# EAGLE design AC based repeater V3 (EAGLE 7.3.0)
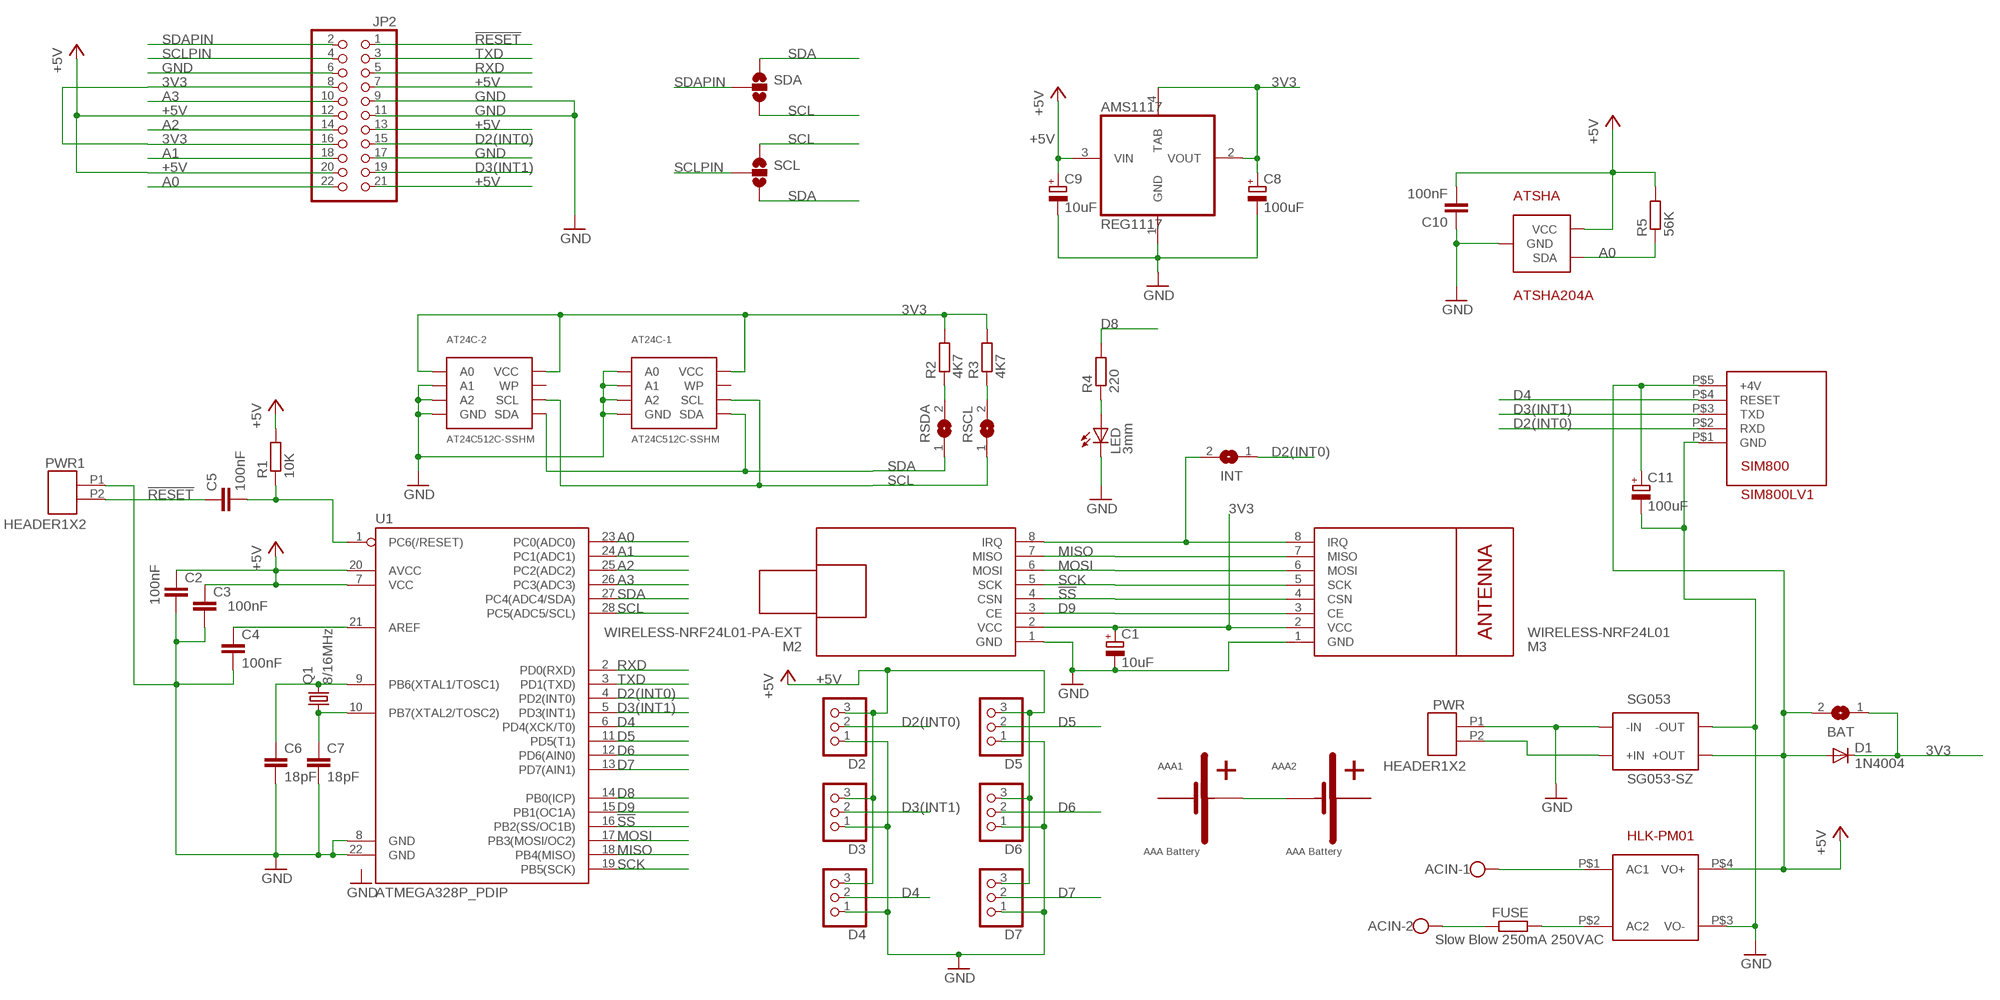
[diagram p0: schematic, sheet 1]

## Parts
AAA1  AAA Battery  AAABATTERYPLUSPIN  [AAABATTERYHOLDERPLUSPIN]
AAA2  AAA Battery  AAABATTERYMINPIN  [AAABATTERYHOLDERMINPIN]
ACIN  W237-102  [W237-102]
AMS1117  REG1117  [SOT223]
AT24C-1  AT24C512C-SSHM  AT24C32SOIC8  [SOIC8]
AT24C-2  AT24C512C-SSHM  AT24C32SOIC8  [SOIC8]
ATSHA  ATSHA204A  [SOT23-R]
BAT  SJ  [SJ]
C1  10uF  CPOL-EUE2.5-5  [E2,5-5]
C2  100nF  C-EU025-025X050  [C025-025X050]
C3  100nF  C-EU025-025X050  [C025-025X050]
C4  100nF  C-EU025-025X050  [C025-025X050]
C5  100nF  C-EU025-025X050  [C025-025X050]
C6  18pF  C-EU025-025X050  [C025-025X050]
C7  18pF  C-EU025-025X050  [C025-025X050]
C8  100uF  CPOL-EUE3.5-8  [E3,5-8]
C9  10uF  CPOL-EUE2.5-5  [E2,5-5]
C10  100nF  C-EU025-025X050  [C025-025X050]
C11  100uF  CPOL-EUE3.5-8  [E3,5-8]
D1  1N4004  [DO41-10]
D2  PINHD-1X3PTH  [1X03]
D3  PINHD-1X3PTH  [1X03]
D4  PINHD-1X3PTH  [1X03]
D5  PINHD-1X3PTH  [1X03]
D6  PINHD-1X3PTH  [1X03]
D7  PINHD-1X3PTH  [1X03]
FUSE  Slow Blow 250mA 250VAC  R-EU_0411/3V  [0411V]
HLK-PM01  HLK-PM01  [HLK-PM01]
INT  SJ  [SJ]
JP2  PINHD-2X11  [2X11]
LED  3mm  LED3MM  [LED3MM]
M2  WIRELESS-NRF24L01-PA-EXT  [WIRELESS-NRD24L01-PA-EXT]
M3  WIRELESS-NRF24L01  [WIRELESS-NRF24L01]
PWR  HEADER1X2  [HEADER1X2]
PWR1  HEADER1X2  [HEADER1X2]
Q1  8/16MHz  CRYSTALHC49U-V  [HC49U-V]
R1  10K  R-EU_0207/7  [0207/7]
R2  4K7  R-EU_0207/7  [0207/7]
R3  4K7  R-EU_0207/7  [0207/7]
R4  220  R-EU_0207/7  [0207/7]
R5  56K  R-EU_0207/7  [0207/7]
RSCL  SJ  [SJ]
RSDA  SJ  [SJ]
SCL  JUMPER-PAD-3-NC_BY_TRACE  [PAD-JUMPER-3-3OF3_NC_BY_TRACE_YES_SILK_FULL_BOX]
SDA  JUMPER-PAD-3-NC_BY_TRACE  [PAD-JUMPER-3-3OF3_NC_BY_TRACE_YES_SILK_FULL_BOX]
SG053  SG053-SZ  [SG053-SZ]
SIM800  SIM800LV1  [SIM800LV1]
U1  ATMEGA328P_PDIP  [DIL28-3]

## Nets
3V3 [dcpower]: AMS1117.2(VOUT) AMS1117.4(TAB) AT24C-1.8(VCC) AT24C-2.1(A0) AT24C-2.8(VCC) BAT.1 C1.+ C8.+ D1.C JP2.8 JP2.16 M2.2(VCC) M3.2(VCC) R2.2 R3.2
!RESET: C5.1 JP2.1 PWR1.P2
!SS: M2.4(CSN) M3.4(CSN) U1.16(PB2(SS/OC1B))
+5V [dcpower]: AMS1117.3(VIN) ATSHA.2(VCC) BAT.2 C2.1 C3.1 C9.+ C10.2 C11.+ D1.A D2.3 D3.3 D4.3 D5.3 D6.3 D7.3 HLK-PM01.P$4(VO+) JP2.7 JP2.12 JP2.13 JP2.20 JP2.21 R1.2 R5.2 SG053.P$5(+OUT) SG053.P$6(+OUT) SIM800.P$5(+4V) U1.7(VCC) U1.20(AVCC)
A0: ATSHA.1(SDA) JP2.22 R5.1 U1.23(PC0(ADC0))
A1: JP2.18 U1.24(PC1(ADC1))
A2: JP2.14 U1.25(PC2(ADC2))
A3: JP2.10 U1.26(PC3(ADC3))
D2(INT0): D2.2 INT.1 JP2.15 SIM800.P$2(RXD) U1.4(PD2(INT0))
D3(INT1): D3.2 JP2.19 SIM800.P$3(TXD) U1.5(PD3(INT1))
D4: D4.2 SIM800.P$4(RESET) U1.6(PD4(XCK/T0))
D5: D5.2 U1.11(PD5(T1))
D6: D6.2 U1.12(PD6(AIN0))
D7: D7.2 U1.13(PD7(AIN1))
D8: R4.2 U1.14(PB0(ICP))
D9: M2.3(CE) M3.3(CE) U1.15(PB1(OC1A))
GND [dcpower]: AMS1117.1(GND) AT24C-1.1(A0) AT24C-1.2(A1) AT24C-1.3(A2) AT24C-1.4(GND) AT24C-2.2(A1) AT24C-2.3(A2) AT24C-2.4(GND) ATSHA.3(GND) C1.- C2.2 C3.2 C4.2 C6.2 C7.2 C8.- C9.- C10.1 C11.- D2.1 D3.1 D4.1 D5.1 D6.1 D7.1 HLK-PM01.P$3(VO-) JP2.6 JP2.9 JP2.11 JP2.17 LED.K(C) M2.1(GND) M3.1(GND) PWR1.P1 PWR.P1 SG053.P$1(-IN) SG053.P$2(-IN) SG053.P$7(-OUT) SG053.P$8(-OUT) SIM800.P$1(GND) U1.8(GND) U1.22(GND)
MISO: M2.7(MISO) M3.7(MISO) U1.18(PB4(MISO))
MOSI: M2.6(MOSI) M3.6(MOSI) U1.17(PB3(MOSI/OC2))
N$1 [dcpower]: PWR.P2 SG053.P$3(+IN) SG053.P$4(+IN)
N$2: R2.1 RSDA.2
N$4 [acpower]: ACIN.2 FUSE.1
N$5: C4.1 U1.21(AREF)
N$6: R3.1 RSCL.2
N$7 [dcpower]: AAA1.P$2 AAA2.P$1
N$8 [acpower]: ACIN.1 HLK-PM01.P$1(AC1)
N$9 [acpower]: FUSE.2 HLK-PM01.P$2(AC2)
N$10: C5.2 R1.1 U1.1(PC6(/RESET))
N$12: INT.2 M2.8(IRQ) M3.8(IRQ)
N$28: LED.A R4.1
N$35: C6.1 Q1.2 U1.9(PB6(XTAL1/TOSC1))
N$36: C7.1 Q1.1 U1.10(PB7(XTAL2/TOSC2))
RXD: JP2.5 U1.2(PD0(RXD))
SCK: M2.5(SCK) M3.5(SCK) U1.19(PB5(SCK))
SCL: AT24C-1.6(SCL) AT24C-2.6(SCL) RSCL.1 SCL.1 SDA.3 U1.28(PC5(ADC5/SCL))
SCLPIN: JP2.4 SCL.2
SDA: AT24C-1.5(SDA) AT24C-2.5(SDA) RSDA.1 SCL.3 SDA.1 U1.27(PC4(ADC4/SDA))
SDAPIN: JP2.2 SDA.2
TXD: JP2.3 U1.3(PD1(TXD))
Unconnected: AT24C-1.7(WP) AT24C-2.7(WP)

## Library data of the parts
AAA1 = GertSanders:AAABATTERYPLUSPIN
AAA2 = GertSanders:AAABATTERYMINPIN
ACIN = con-wago-500:W237-102: WAGO SCREW CLAMP; MPN: 237-102; OC_FARNELL: unknown; OC_NEWARK: 70K9898
AMS1117 = BaseApp:REG1117: 800mA and 1A Low Dropout (LDO) Positive Regulator 1.8V, 2.5V, 2.85V, 3.3V, 5V, and Adj http://www.digikey.com/product-detail/en/LM1117MPX-3.3%2FNOPB/LM1117MPX-3.3CT-ND/1010516
AT24C-1 AT24C-2 = GertSanders:AT24C32
ATSHA = GertSanders:ATSHA204A
BAT INT RSCL RSDA = jumper:SJ: SMD solder JUMPER
C1 C8 C9 C11 = rcl:CPOL-EU: POLARIZED CAPACITOR, European symbol
C2-C7 C10 = GertSanders:C-EU: CAPACITOR, European symbol
D1 = diode:1N4004: DIODE general purpose rectifier, 1 A
D2-D7 = digital-toy:PINHD-1X3: PIN HEADER
FUSE R1-R5 = rcl:R-EU_: RESISTOR, European symbol
HLK-PM01 = GertSanders:HLK-PM01: HI-LINK Ultra-compact power module HLK-PM01 Meet UL, CE requirements Ultra-thin, ultra-small All voltage input (AC: 90 ~ 264V) Low ripple and low noise Output overload and short circuit protection High efficiency, high power density The product is designed to meet the requirements of EMC and Safety Test Low power consumption, environmental protection, no-load loss <0.1W 100% load aging and testing
JP2 = pinhead:PINHD-2X11: PIN HEADER
LED = adafruit:LED: LED OSRAM: - CHIPLED LG R971, LG N971, LY N971, LG Q971, LY Q971, LO R971, LY R971 LH N974, LH R974 LS Q976, LO Q976, LY Q976 LO Q996 - Hyper CHIPLED LW Q18S LB Q993, LB Q99A, LB R99A - SideLED LS A670, LO A670, LY A670, LG A670, LP A670 LB A673, LV A673, LT A673, LW A673 LH A674 LY A675 LS A676, LA A676, LO A676, LY A676, LW A676 LS A679, LY A679, LG A679 - Hyper Micro SIDELED® LS Y876, LA Y876, LO Y876, LY Y876 LT Y87S - SmartLED LW L88C, LW L88S LB L89C, LB L89S, LG L890 LS L89K, LO L89K, LY L89K LS L896, LA L896, LO L896, LY L896 - TOPLED LS T670, LO T670, LY T670, LG T670, LP T670 LSG T670, LSP T670, LSY T670, LOP T670, LYG T670 LG T671, LOG T671, LSG T671 LB T673, LV T673, LT T673, LW T673 LH T674 LS T676, LA T676, LO T676, LY T676, LB T676, LH T676, LSB T676, LW T676 LB T67C, LV T67C, LT T67C, LS T67K, LO T67K, LY T67K, LW E67C LS E67B, LA E67B, LO E67B, LY E67B, LB E67C, LV E67C, LT E67C LW T67C LS T679, LY T679, LG T679 LS T770, LO T770, LY T770, LG T770, LP T770 LB T773, LV T773, LT T773, LW T773 LH T774 LS E675, LA E675, LY E675, LS T675 LS T776, LA T776, LO T776, LY T776, LB T776 LHGB T686 LT T68C, LB T68C - Hyper Mini TOPLED® LB M676 - Mini TOPLED Santana® LG M470 LS M47K, LO M47K, LY M47K Source: http://www.osram.convergy.de/
M2 = GertSanders:WIRELESS-NRF24L01-PA-EXT: 2.4 GHz Wireless Module based on NRF24L01 chip with preamplifier and external antenna
M3 = GertSanders:WIRELESS-NRF24L01: 2.4 GHz Wireless Module based on NRF24L01 chip
PWR PWR1 = anton:HEADER1X2
Q1 = crystal:CRYSTAL: CRYSTAL; OC_FARNELL: 1666969; OC_NEWARK: unknown
SCL SDA = GertSanders:JUMPER-PAD-3-NC_BY_TRACE
SG053 = GertSanders:SG053-SZ
SIM800 = GertSanders:SIM800LV1
U1 = GertSanders:ATMEGA328P_PDIP: uC used in the Arduino 32kb flash, 1k EEPROM, 2k SRAM This is the through-hole version of this chip.

## Net classes
1 dcpower: width 0.635 mm
2 acpower: width 2.54 mm, clearance 1.524 mm

## Board
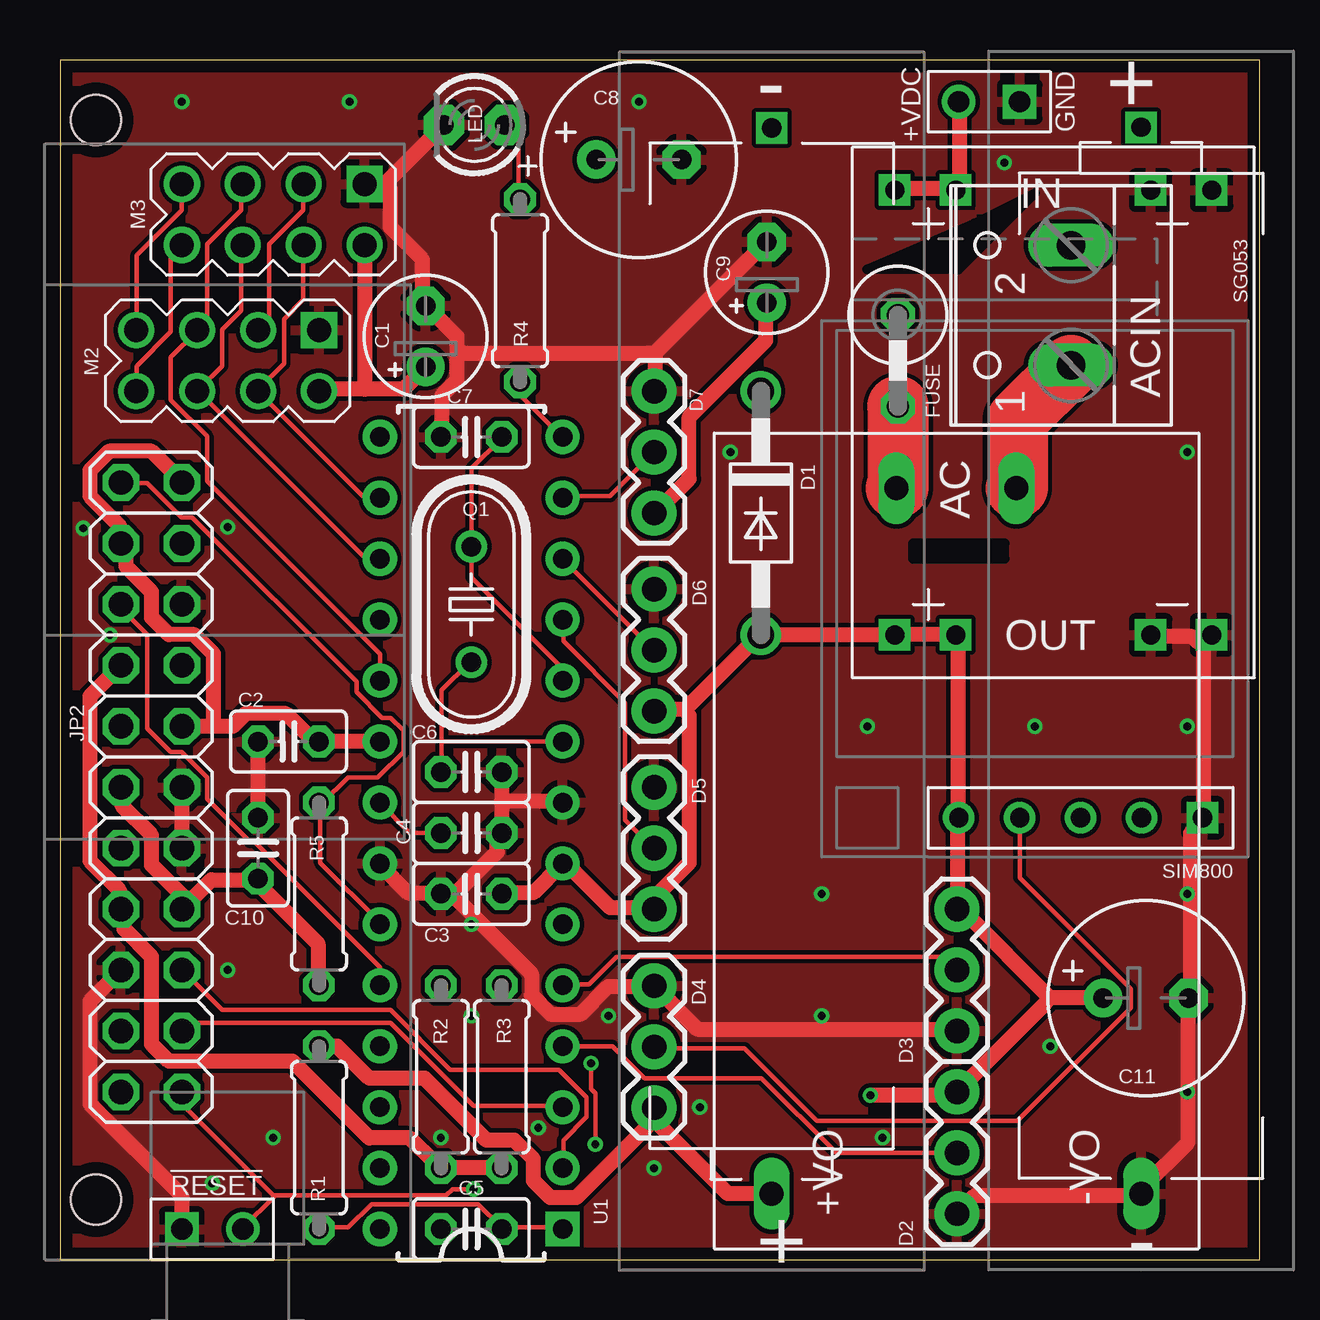
[diagram p1: board, top side]
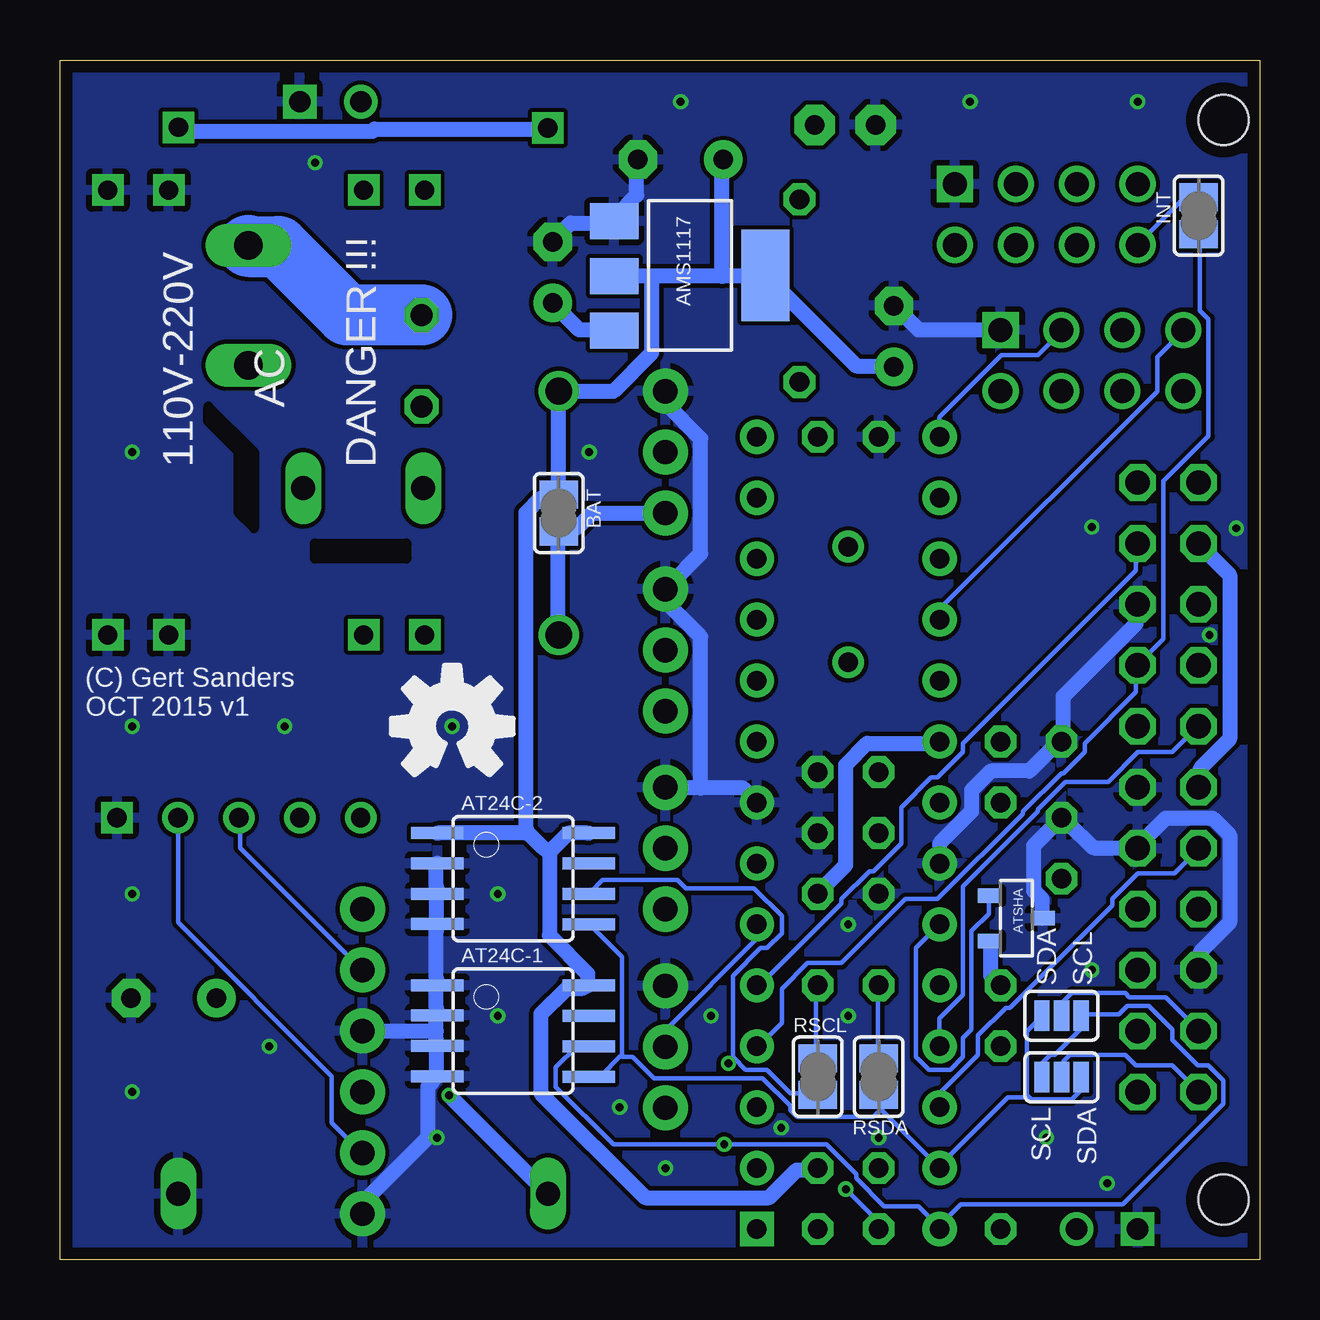
[diagram p2: board, bottom side, seen from below]

Size 50 x 50 mm. Coordinates in mm from the lower left corner, seen from the top.
Outline: 0,0 50,0 50,50 0,50 0,0
Copper layers (1*16): Top 0.035mm / dielectric 1.5mm / Bottom 0.035mm
Design rules "ShenZhen2U EagleRules": minimum track width 7mil, minimum drill 12mil, track to track 7mil, track to pad 7mil, pad to pad 7mil, via to via 7mil, smd to smd 0mil, copper to edge 20mil, drill to drill 10mil, minimum pad ring 10mil, minimum via ring 6mil, stop-mask expansion 2mil, vias tented up to drill 25mil, thermal gap 10mil
Holes 2.1 mm at 1.5,2.5 1.5,47.5
tRestrict: area 33.7,41.3 to 40.6,44.5; area 35.6,29.2 to 39.4,29.8
bRestrict: area 41.9,30.5 to 43.8,35.6; area 35.6,29.2 to 39.4,29.8

### Footprints (pad centres in the part's own frame; a part is rotated, then mirrored left to right if it is on the bottom)
AAABATTERYHOLDERPLUSPIN = drill 0.8 square: P$2 22.225,0
AAABATTERYHOLDERMINPIN = drill 0.8 square: P$1 -22.225,0
W237-102 = drill 1.194 long: 1 -2.5,-1.27; 2 2.5,-1.27
SOT223 = smd 1.499 x 2.007: 1 -2.261,-3.15; 2 0.025,-3.15; 3 2.311,-3.15 | smd 3.81 x 2.007: 4 0,3.15
SOIC8 = smd 0.5 x 2.2: 1 -1.905,-3.154; 2 -0.645,-3.154; 3 0.625,-3.154; 4 1.895,-3.154; 5 1.905,3.154; 6 0.635,3.154; 7 -0.635,3.154; 8 -1.905,3.154
SOT23-R = smd 0.6 x 1: 1 -0.95,-1.1; 2 0.95,-1.1; 3 0,1.1
SJ = smd 1.168 x 1.6: 1 -0.762,0; 2 0.762,0
E2,5-5 = drill 0.813 pad 1.6: + -1.27,0 | drill 0.813 pad 1.6 octagon: - 1.27,0
C025-025X050 = drill 0.813 octagon: 1 -1.27,0; 2 1.27,0
E3,5-8 = drill 0.813 pad 1.6: + -1.778,0 | drill 0.813 pad 1.6 octagon: - 1.778,0
DO41-10 = drill 1.118: A 5.08,0; C -5.08,0
1X03 = drill 1.016 pad 1.88: 1 0,0; 2 2.54,0; 3 5.08,0
0411V = drill 0.914 octagon: 1 -2.54,0; 2 1.27,0
HLK-PM01 = drill 1 long: P$1 -14.7,2.5; P$2 -14.7,-2.5; P$3 14.7,7.7; P$4 14.7,-7.7
2X11 = drill 1.016 octagon: 1 -12.7,-1.27; 2 -12.7,1.27; 3 -10.16,-1.27; 4 -10.16,1.27; 5 -7.62,-1.27; 6 -7.62,1.27; 7 -5.08,-1.27; 8 -5.08,1.27; 9 -2.54,-1.27; 10 -2.54,1.27; 11 0,-1.27; 12 0,1.27; 13 2.54,-1.27; 14 2.54,1.27; 15 5.08,-1.27; 16 5.08,1.27; 17 7.62,-1.27; 18 7.62,1.27; 19 10.16,-1.27; 20 10.16,1.27; 21 12.7,-1.27; 22 12.7,1.27
LED3MM = drill 0.813 pad 1.676 octagon: A -1.27,0; K 1.27,0
WIRELESS-NRD24L01-PA-EXT = drill 1 square: 1 -17.755,3.81 | drill 1: 2 -15.215,3.81; 3 -17.755,1.27; 4 -15.215,1.27; 5 -17.755,-1.27; 6 -15.215,-1.27; 7 -17.755,-3.81; 8 -15.215,-3.81
WIRELESS-NRF24L01 = drill 1 square: 1 -12.7,6.35 | drill 1: 2 -10.16,6.35; 3 -12.7,3.81; 4 -10.16,3.81; 5 -12.7,1.27; 6 -10.16,1.27; 7 -12.7,-1.27; 8 -10.16,-1.27
HEADER1X2 = drill 0.889 square: P1 0,1.27 | drill 0.889: P2 0,-1.27
HC49U-V = drill 0.813: 1 -2.413,0; 2 2.413,0
0207/7 = drill 0.813 octagon: 1 -3.81,0; 2 3.81,0
PAD-JUMPER-3-3OF3_NC_BY_TRACE_YES_SILK_FULL_BOX = smd 0.635 x 1.27: 1 -0.813,0; 2 0,0; 3 0.813,0
SG053-SZ = drill 0.8 square: P$1 -8.382,6.096; P$2 -8.382,3.556; P$3 -8.382,-4.572; P$4 -8.382,-7.112; P$5 10.16,-7.112; P$6 10.16,-4.572; P$7 10.16,3.556; P$8 10.16,6.096
SIM800LV1 = drill 0.8 square: P$1 1.27,1.27 | drill 0.8: P$2 1.27,3.81; P$3 1.27,6.35; P$4 1.27,8.89; P$5 1.27,11.43
DIL28-3 = drill 0.813 pad 1.422 square: 1 -16.51,-3.81 | drill 0.813 pad 1.422: 2 -13.97,-3.81; 3 -11.43,-3.81; 4 -8.89,-3.81; 5 -6.35,-3.81; 6 -3.81,-3.81; 7 -1.27,-3.81; 8 1.27,-3.81; 9 3.81,-3.81; 10 6.35,-3.81; 11 8.89,-3.81; 12 11.43,-3.81; 13 13.97,-3.81; 14 16.51,-3.81; 15 16.51,3.81; 16 13.97,3.81; 17 11.43,3.81; 18 8.89,3.81; 19 6.35,3.81; 20 3.81,3.81; 21 1.27,3.81; 22 -1.27,3.81; 23 -3.81,3.81; 24 -6.35,3.81; 25 -8.89,3.81; 26 -11.43,3.81; 27 -13.97,3.81; 28 -16.51,3.81

### Placement (x,y rotation side)
AAA1  45.06,24.97 90 top
AAA2  29.67,24.94 270 top
ACIN  40.87,39.78 90 top
AMS1117  23.75,41.02 270 bottom
AT24C-1  31.11,9.53 270 bottom
AT24C-2  31.11,15.88 270 bottom
ATSHA  10.13,14.22 270 bottom
BAT  29.21,31.11 270 bottom
C1  15.24,38.48 90 top
C2  9.53,21.59 180 top
C3  17.14,15.24 180 top
C4  17.14,17.78 0 top
C5  17.14,1.27 0 top
C6  17.14,20.32 0 top
C7  17.14,34.29 180 top
C8  24.13,45.85 0 top
C9  29.46,41.15 90 top
C10  8.26,17.14 270 top
C11  45.26,10.9 0 top
D1  29.21,31.11 270 top
D2  37.39,1.91 90 top
D3  37.39,9.53 90 top
D4  24.77,11.4 270 top
D5  24.77,19.68 270 top
D6  24.77,27.94 270 top
D7  24.77,36.2 270 top
FUSE  34.92,36.83 270 top
HLK-PM01  37.36,17.45 270 top
INT  2.54,43.51 90 bottom
JP2  3.81,19.68 90 top
LED  17.27,47.29 180 top
M2  6.99,20.98 270 top
M3  6.35,32.13 270 top
PWR  38.73,48.26 270 top
PWR1  6.35,1.27 90 top
Q1  17.14,27.3 270 top
R1  10.79,5.08 90 top
R2  15.88,7.62 270 top
R3  18.41,7.62 270 top
R4  19.18,40.39 270 top
R5  10.79,15.24 270 top
RSCL  18.41,7.62 90 bottom
RSDA  15.88,7.62 90 bottom
SCL  8.26,10.16 180 bottom
SDA  8.26,7.59 180 bottom
SG053  41.91,36.2 270 top
SIM800  48.9,17.14 90 top
U1  17.14,17.78 90 top
U$1  [OSHWLOGO_TOL_0.2]  33.66,22.23 0 bottom

### Tracks (layer width: path | path; a pad name or v marks a point on that pad's centre or on a via)
3V3
  Top 0.635: 12.71,36.27 14.31,36.27 15.2,37.16 C1.+ | 12.71,36.27 10.85,36.27 M2.2 | M3.2 12.71,42.23 12.71,36.54 12.71,36.27 | JP2.16 2.49,24.71 1.25,23.47 1.25,16.62 2.49,15.38 2.49,14.67 JP2.8 2.67,14.31 2.67,13.78 3.82,12.62 3.82,8.98 4.53,8.27 9.69,8.27 12.89,5.07 14.58,5.07 15.65,4 R2.2 15.91,3.82 18.4,3.82 R3.2
  Bottom 0.635: 22.4,40.98 20.62,40.98 AMS1117.4 20.36,40.8 16.8,37.25 15.29,37.25 C1.+ | 22.4,40.98 25.34,40.98 | 25.34,40.98 26.85,40.98 AMS1117.2 | C8.+ 22.4,45.78 22.4,41.25 22.4,40.98 | 25.34,40.98 25.34,40.72 25.34,37.78 26.94,36.18 28.89,36.18 D1.C 29.25,36.18 29.25,31.91 BAT.1 29.52,31.74 29.96,31.74 30.58,31.11 30.58,18.05 30.58,17.78 | 29.6,16.98 29.6,13.51 28,11.91 28,11.47 AT24C-1.8 28.27,11.29 28.89,11.29 29.96,10.22 29.96,6.93 25.6,2.58 20.45,2.58 19.29,3.73 18.49,3.73 R3.2 | 29.6,16.98 28.8,17.78 28,17.78 AT24C-2.8 | 30.58,17.78 30.49,17.78 29.87,17.16 29.6,16.98 | 30.58,17.78 34.23,17.78 AT24C-2.1
!RESET  (via drill 0.33)
  Top 0.178: v17.25,2.93 16.36,2.93 16.09,2.67 8.98,2.67 8.93,2.62 | 8.93,2.62 7.64,1.33 PWR1.P2 | JP2.1 5.16,6.93 5.16,6.4 8.89,2.67 8.93,2.62
  Bottom 0.178: v17.25,2.93 15.91,1.6 15.91,1.33 C5.1
!SS
  Top 0.178: U1.16 13.34,31.83 12.62,31.83 8.27,36.18 M2.4 8.27,36.27 9.34,37.34 9.34,39.2 10.13,40.01 10.13,42.23 M3.4
+5V  (via drill 0.33)
  Top 0.635: R5.2 10.76,11.47 10.76,13.16 8.36,15.56 C10.2 8.18,15.82 6.31,15.82 5.16,14.67 JP2.7 5.16,15.11 3.82,16.45 3.82,17.69 2.58,18.94 2.58,19.65 JP2.12 | JP2.21 5.07,32.45 3.82,33.69 2.04,33.69 1.25,32.89 1.25,31.83 2.49,30.58 2.49,29.87 JP2.20 2.76,29.6 2.76,28.89 3.82,27.83 3.82,26.76 4.53,26.05 5.6,26.05 6.4,25.25 6.4,22.49 6.4,22.23 | U1.20 13.34,21.6 10.85,21.6 C2.1 10.49,21.69 9.42,22.76 7.73,22.76 7.2,22.23 6.4,22.23 | 6.4,22.23 5.16,22.23 JP2.13 | R1.2 10.85,8.89 11.56,8.89 12.89,7.56 15.2,7.56 17.78,4.98 18.94,4.98 19.74,4.18 19.74,3.29 20.45,2.58 21.51,2.58 24.71,5.78 24.71,6.31 D4.3 24.98,5.6 27.83,2.76 29.6,2.76 HLK-PM01.P$4 | 41.25,10.94 43.47,10.94 C11.+ | 41.25,10.94 37.69,14.49 D3.3 37.43,14.67 37.43,18.4 SIM800.P$5 37.43,18.67 37.43,25.78 SG053.P$6 34.85,26.05 SG053.P$5 34.49,26.05 29.25,26.05 D1.A 28.98,25.87 26.05,22.94 | 41.25,10.94 41.07,10.67 37.43,7.02 D2.3 37.16,6.84 v33.78,6.84 | C3.1 18.49,15.29 19.74,15.29 20.89,16.45 U1.7 21.25,16.36 22.94,14.67 24.71,14.67 D5.3 24.89,14.94 24.89,15.2 26.23,16.54 26.23,22.67 26.05,22.94 | 26.05,22.94 24.8,22.94 D6.3 | C9.+ 29.43,39.83 29.43,38.32 26.23,35.12 26.23,32.54 24.8,31.11 D7.3
  Bottom 0.635: ATSHA.2 11.2,13.25 11.2,11.82 10.85,11.47 R5.2 | JP2.12 2.49,19.74 2.49,20.45 1.25,21.69 1.25,28.54 2.49,29.78 JP2.20 | AMS1117.3 26.94,38.76 28.36,38.76 29.43,39.83 C9.+ | D1.A 29.25,26.05 29.25,30.32 BAT.2 28.98,30.49 28.45,30.49 27.83,31.11 24.8,31.11 D7.3 | v33.78,6.84 29.69,2.76 HLK-PM01.P$4 | U1.20 13.34,21.51 16.36,21.51 17.25,20.62 17.25,16.45 18.4,15.29 C3.1
A0
  Top 0.178: U1.23 13.34,14.05 10.85,16.54 10.85,19.02 R5.1 10.94,19.02 12,20.09 13.25,20.09 14.31,21.16 14.31,22.05 13.78,22.58 13.42,22.58 12.36,23.65 12.36,24.09 5.51,30.94 5.07,30.94 3.65,32.36 2.58,32.36 JP2.22
  Bottom 0.178: ATSHA.1 11.29,15.11 11.29,14.4 12,13.69 12,9.6 12.36,9.25 12.36,8.45 12.89,7.91 13.78,7.91 14.31,8.45 14.31,12.98 13.34,13.96 U1.23
A1
  Top 0.178: U1.24 13.34,11.47 13.34,12.18 8.09,17.42 7.91,17.42 6.13,19.2 6.13,20.09 5.07,21.16 4.62,21.16 3.65,22.14 3.65,26.05 2.58,27.11 2.58,27.29 JP2.18
A2
  Bottom 0.178: U1.25 13.34,10.05 12.36,11.02 12.36,15.56 9.25,18.67 9.25,18.76 8.09,19.91 6.31,19.91 5.07,21.16 3.65,21.16 2.58,22.23 JP2.14
A3
  Bottom 0.178: U1.26 13.34,6.4 13.34,6.93 11.73,8.53 11.73,9.34 10.58,10.49 10.4,10.49 6.13,14.76 6.13,15.02 5.07,16.09 3.56,16.09 2.58,17.07 JP2.10
D2(INT0)
  Top 0.178: U1.4 20.98,8.89 23.02,8.89 24.36,7.56 29.25,7.56 32.36,4.45 37.34,4.45 D2.2
  Bottom 0.178: INT.1 2.49,42.67 2.49,39.56 2.13,39.2 2.13,34.31 4,32.45 4,25.87 5.07,24.8 JP2.15 5.16,24.71 5.16,23.65 7.29,21.51 7.29,21.16 8.18,20.27 8.27,20.27 9.87,18.67 9.87,18.58 13.42,15.02 14.76,15.02 17.42,12.36 18.85,12.36 19.91,11.29 19.91,9.87 20.89,8.89 U1.4 | SIM800.P$2 45.07,18.4 45.07,14.05 38.67,7.64 38.67,5.69 37.43,4.45 D2.2
D3(INT1)
  Top 0.178: U1.5 20.98,11.47 22.05,11.47 23.2,12.62 36.8,12.62 37.34,12.09 D3.2
  Bottom 0.178: SIM800.P$3 42.49,18.4 42.49,17.16 37.43,12.09 D3.2 | JP2.19 5.16,29.78 5.16,28.71 12.36,21.51 12.36,21.16 13.42,20.09 13.69,20.09 14.94,18.85 14.94,17.34 16.09,16.18 16.27,16.18 17.42,15.02 17.42,14.85 20.89,11.38 U1.5
D4
  Top 0.178: SIM800.P$4 40.01,15.91 44.63,11.29 44.63,10.49 39.92,5.78 31.56,5.78 28.54,8.8 24.8,8.8 D4.2
  Bottom 0.178: U1.6 20.98,13.96 20.98,13.34 24.71,9.6 24.71,8.89 D4.2
D5
  Top 0.178: U1.11 20.98,26.67 20.98,25.78 23.56,23.2 23.56,18.31 24.71,17.16 D5.2
D6
  Top 0.178: U1.12 20.98,29.16 24.71,25.43 D6.2
D7
  Top 0.178: U1.13 20.98,31.83 22.94,31.83 24.71,33.6 D7.2
D8
  Top 0.178: R4.2 19.2,36.54 19.2,36.01 20.89,34.31 U1.14
D9
  Top 0.178: M3.3 10.13,44.81 10.13,43.74 8.71,42.32 8.71,39.2 8.27,38.76 M2.3
  Bottom 0.178: U1.15 13.34,34.31 13.34,35.12 10.76,37.69 9.25,37.69 8.27,38.67 M2.3
GND  (via drill 0.33)
  Top 0.635: SG053.P$7 45.52,25.96 47.21,25.96 47.38,25.78 SG053.P$8 48.01,25.96 47.65,25.6 47.65,18.49 SIM800.P$1 47.47,18.14 47.12,17.78 47.12,10.94 C11.- 47.03,10.58 47.03,4.89 45.16,3.02 HLK-PM01.P$3 44.98,2.67 38.14,2.67 37.43,1.96 D2.1 | 24.8,37.78 24.8,36.27 D7.1 | 24.8,37.78 29.43,42.41 C9.- | 13.6,44.9 12.71,44.9 M3.1 | LED.K 13.6,44.9 | 16.54,37.78 16.54,38.49 15.29,39.74 C1.- 15.11,40.01 15.11,41.69 13.78,43.03 13.78,44.63 13.6,44.9 | 16.54,37.78 16.54,36.63 15.91,36.01 15.91,34.31 C7.2 | 24.8,37.78 24.54,37.78 16.8,37.78 16.54,37.78 | 18.4,19.11 18.4,20.27 C6.2 | 18.4,19.11 C4.2 18.22,17.51 18.22,16.98 16.62,15.38 16.45,15.11 | U1.8 20.89,19.11 18.67,19.11 18.4,19.11 | U1.22 13.34,16.45 14.49,15.29 15.82,15.29 C3.2 16.18,15.11 16.45,15.11 | 16.45,15.11 19.65,11.91 19.65,11.02 20.45,10.22 21.69,10.22 22.85,11.38 24.71,11.38 D4.1 24.98,11.2 26.58,9.6 37.34,9.6 D3.1 | PWR1.P1 5.07,1.33 5.07,2.67 1.25,6.49 1.25,10.76 2.49,12 JP2.6 | JP2.9 5.07,17.16 5.07,19.65 JP2.11 | C2.2 8.27,21.51 8.27,18.49 C10.1
  Bottom 0.635: AT24C-2.2 34.31,16.45 34.31,15.56 AT24C-2.3 34.31,15.2 34.31,14.05 AT24C-2.4 34.31,13.69 34.31,11.73 AT24C-1.1 34.31,11.38 34.31,10.49 AT24C-1.2 34.31,10.13 34.31,9.51 | 34.31,8.89 34.31,7.64 | 34.31,7.64 AT24C-1.4 | 34.31,8.89 AT24C-1.3 | 34.31,9.51 34.31,9.16 34.31,8.89 | D3.1 37.34,9.51 34.58,9.51 34.31,9.51 | D2.1 37.34,1.96 37.34,2.4 34.67,5.07 34.67,7.2 34.49,7.38 34.31,7.64 | C9.- 29.43,42.49 28.71,43.2 26.94,43.2 AMS1117.1 26.76,43.56 25.96,44.36 25.96,45.78 C8.- | M2.1 10.85,38.76 14.22,38.76 15.2,39.74 C1.- | 23.29,19.65 21.51,19.65 20.98,19.11 U1.8 | 23.29,19.65 24.71,19.65 D5.1 | 23.29,19.65 23.29,19.91 23.29,25.96 24.71,27.38 24.71,27.91 D6.1 24.54,28.18 23.29,29.43 23.29,34.23 24.71,35.65 24.71,36.18 D7.1 | ATSHA.3 9.07,14.22 9.07,15.02 9.42,15.38 9.42,17.25 C10.1 8,18.22 6.93,17.16 5.16,17.16 JP2.9 4.89,17.42 3.91,18.4 1.96,18.4 1.25,17.69 1.25,14.05 2.49,12.8 2.49,12.09 JP2.6 | JP2.17 5.16,27.29 5.16,26.49 8.18,23.47 8.18,21.6 C2.2 8.53,21.43 9.6,20.36 11.2,20.36 12,19.56 12,18.67 13.34,17.34 13.34,16.54 U1.22
  other vias: 41.27,8.89 26.67,6.35 24.77,3.81 34.29,5.08 6.35,3.17 8.89,5.08 6.99,12.06 15.88,5.08 17.14,10.16 17.14,13.97 22.86,10.16 0.97,30.48 2.08,26.04 6.99,30.53 19.94,5.49 27.94,33.66 39.37,45.72 46.99,22.23 40.64,22.23 33.66,22.23 46.99,33.66 31.75,15.24 31.75,10.16 5.08,48.26 12.06,48.26 24.13,48.26 46.99,15.24 46.99,6.99
  pour Top: -1.27,-1.27 52.07,-1.27 52.07,51.44 -1.27,51.44
  pour Bottom: -1.27,-1.27 52.07,-1.27 52.07,51.44 -1.27,51.44
MISO
  Top 0.178: M3.7 5.07,44.81 5.07,43.74 3.2,41.87 3.2,38.76 M2.7
  Bottom 0.178: U1.18 13.34,27.11 4.27,36.18 4.27,37.6 3.2,38.67 M2.7
MOSI
  Top 0.178: U1.17 13.34,29.25 12.71,29.25 5.78,36.18 M2.6 5.78,36.27 6.76,37.25 6.76,38.76 7.56,39.56 7.56,42.23 M3.6
N$1
  Top 0.635: SG053.P$4 34.85,44.63 37.34,44.63 SG053.P$3 37.52,44.9 37.52,48.18 PWR.P2
N$2
  Bottom 0.178: RSDA.2 15.91,8.45 15.91,11.38 R2.1
N$4
  Bottom 2.54: FUSE.1 34.94,39.38 38.05,39.38 40.89,42.23 42.14,42.23 ACIN.2
N$5
  Top 0.178: C4.1 15.82,17.78 14.58,17.78 13.34,19.02 U1.21
N$6
  Bottom 0.178: RSCL.2 18.49,8.45 18.49,11.38 R3.1
N$7
  Bottom 0.635: AAA2.P$1 29.69,47.12 36.89,47.12 36.98,47.03 44.9,47.03 44.98,47.12 AAA1.P$2
N$8
  Top 2.54: HLK-PM01.P$1 39.92,32.18 39.92,35.03 42.14,37.25 ACIN.1
N$9
  Top 2.54: FUSE.2 34.94,35.56 34.94,32.18 HLK-PM01.P$2
N$10
  Top 0.178: R1.1 10.85,1.33 12,1.33 12.98,2.31 17.42,2.31 18.4,1.33 C5.2 18.49,1.33 20.89,1.33 U1.1
N$12
  Top 0.178: M2.8 3.2,36.27 3.2,37.25 4.62,38.67 4.62,41.78 5.07,42.23 M3.8
  Bottom 0.178: INT.2 2.58,44.27 3.11,44.27 5.07,42.32 M3.8
N$28
  Top 0.178: R4.1 19.11,44.27 19.11,46.76 18.58,47.3 LED.A
N$35
  Top 0.178: 15.91,21.6 15.91,23.74 17.07,24.89 Q1.2 | 15.91,21.6 15.91,20.36 C6.1 | 20.89,21.6 U1.9 20.8,21.6 15.91,21.6
N$36
  Top 0.178: C7.1 18.4,34.23 17.16,32.98 17.16,29.78 Q1.1 17.16,29.69 17.16,28.43 20.89,24.7 20.89,24.18 U1.10
RXD
  Top 0.178: U1.2 20.98,3.82 20.98,4.98 21.96,5.96 21.96,6.76 20.8,7.91 16.27,7.91 13.78,10.4 6.76,10.4 5.16,12 JP2.5
SCK
  Top 0.178: U1.19 13.34,24.18 13.34,25.25 6.13,32.45 6.13,34.31 4.62,35.83 4.62,37.6 5.69,38.67 M2.5 5.78,38.76 6.13,39.12 6.13,42.32 7.56,43.74 7.56,44.81 M3.5
SCL  (via drill 0.33)
  Top 0.178: v22.14,8.18 22.14,7.11 22.31,6.93 v22.31,4.8
  Bottom 0.178: 21.91,8.4 21.96,8.45 21.96,11.82 20.8,12.98 20.54,12.98 19.91,13.6 19.91,14.31 21.07,15.47 23.91,15.47 24.27,15.82 27.38,15.82 27.91,15.29 AT24C-2.6 | 21.91,8.4 21.43,7.91 20.54,7.91 19.56,6.93 18.49,6.93 RSCL.1 | SDA.3 9.07,7.64 9.07,8.18 8.71,8.53 8.53,8.53 7.47,9.6 7.47,10.13 SCL.1 7.38,10.22 5.87,10.22 5.51,10.58 4.62,10.58 3.65,9.6 3.65,9.16 2.58,8.09 2.13,8.09 1.51,7.47 1.51,6.49 5.69,2.31 12.45,2.31 13.34,1.42 U1.28 13.34,1.33 14.22,2.22 15.65,2.22 16.8,3.38 16.8,3.56 18.05,4.8 v22.31,4.8 26.94,4.8 29.34,7.2 29.34,8 28.45,8.89 28,8.89 AT24C-1.6 | v22.14,8.18 21.96,8.36 21.91,8.4
SCLPIN
  Bottom 0.178: SCL.2 8.18,10.22 8.18,10.76 7.82,11.11 5.6,11.11 5.42,10.94 3.91,10.94 2.58,9.6 JP2.4
SDA
  Bottom 0.178: 26.63,8.49 26.58,8.53 26.58,12.62 27.91,13.96 AT24C-2.5 | 26.63,8.49 27.47,7.64 27.91,7.64 AT24C-1.5 | 9.65,6.8 9.69,6.84 9.69,9.51 9.07,10.13 SCL.3 | 9.65,6.8 9.51,6.67 7.82,6.67 7.47,7.02 7.47,7.56 SDA.1 | 15.78,6.27 13.34,3.82 U1.27 13.34,3.91 10.49,6.76 9.69,6.76 9.65,6.8 | 15.78,6.27 15.82,6.31 15.82,6.84 RSDA.1 | 26.63,8.49 26.58,8.45 26.14,8.45 25.25,7.56 20.71,7.56 19.56,6.4 19.56,6.22 19.29,5.96 16.09,5.96 15.82,6.22 15.78,6.27
SDAPIN
  Bottom 0.178: SDA.2 8.18,7.64 8.18,8.27 7.91,8.53 5.6,8.53 5.16,8.09 3.65,8.09 2.58,7.02 JP2.2
TXD
  Top 0.178: U1.3 20.89,6.4 17.25,6.4 13.78,9.87 5.42,9.87 5.16,9.6 JP2.3

### Text on the board
tPlace: +VDC | GND | !RESET
bPlace: 110V-220V / / AC / / DANGER !!! | (C) Gert Sanders / OCT 2015 v1 | SDA | SCL